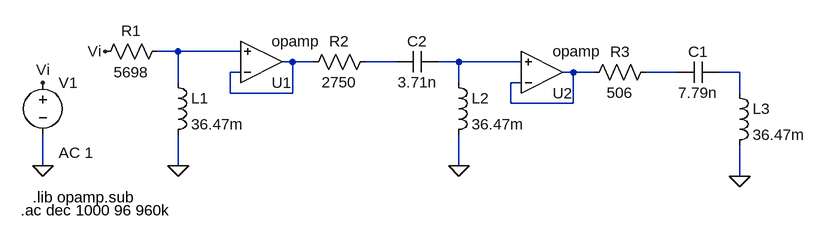
[diagram p0: schematic circ.asc]
circ.asc, the LTspice schematic file:
Version 4
SHEET 1 1008 680
WIRE 32 112 0 112
WIRE 128 112 32 112
WIRE 208 128 192 128
WIRE 240 128 208 128
WIRE 368 128 320 128
WIRE 464 128 432 128
WIRE 560 128 464 128
WIRE 128 144 112 144
WIRE 640 144 624 144
WIRE 672 144 640 144
WIRE 800 144 752 144
WIRE 896 144 864 144
WIRE 32 160 32 112
WIRE 464 160 464 128
WIRE 560 160 544 160
WIRE 112 176 112 144
WIRE 208 176 208 128
WIRE 208 176 112 176
WIRE 896 176 896 144
WIRE 544 192 544 160
WIRE 640 192 640 144
WIRE 640 192 544 192
WIRE -176 288 -176 240
WIRE 32 288 32 240
WIRE 464 288 464 240
WIRE 896 304 896 256
FLAG 32 288 0
FLAG -176 288 0
FLAG -176 160 Vi
FLAG -80 112 Vi
FLAG 464 288 0
FLAG 896 304 0
SYMBOL res 16 96 R90
WINDOW 0 0 56 VBottom 2
WINDOW 3 32 56 VTop 2
SYMATTR InstName R1
SYMATTR Value 5698
SYMBOL ind 16 144 R0
SYMATTR InstName L1
SYMATTR Value 36.47m
SYMBOL voltage -176 144 R0
WINDOW 123 24 124 Left 2
WINDOW 39 0 0 Left 0
SYMATTR InstName V1
SYMATTR Value ""
SYMATTR Value2 AC 1
SYMBOL OpAmps\\opamp 160 192 M180
SYMATTR InstName U1
SYMBOL res 336 112 R90
WINDOW 0 0 56 VBottom 2
WINDOW 3 32 56 VTop 2
SYMATTR InstName R2
SYMATTR Value 2750
SYMBOL cap 432 112 R90
WINDOW 0 0 32 VBottom 2
WINDOW 3 32 32 VTop 2
SYMATTR InstName C2
SYMATTR Value 3.71n
SYMBOL ind 448 144 R0
SYMATTR InstName L2
SYMATTR Value 36.47m
SYMBOL OpAmps\\opamp 592 208 M180
SYMATTR InstName U2
SYMBOL res 768 128 R90
WINDOW 0 0 56 VBottom 2
WINDOW 3 32 56 VTop 2
SYMATTR InstName R3
SYMATTR Value 506
SYMBOL cap 864 128 R90
WINDOW 0 0 32 VBottom 2
WINDOW 3 32 32 VTop 2
SYMATTR InstName C1
SYMATTR Value 7.79n
SYMBOL ind 880 160 R0
SYMATTR InstName L3
SYMATTR Value 36.47m
TEXT -192 336 Left 2 !.lib opamp.sub
TEXT -210 356 Left 2 !.ac dec 1000 96 960k

The netlist it stands for:
* circ.asc
R1 N001 Vi 5698
L1 N001 0 36.47m
V1 Vi 0 AC 1
XU1 N002 N001 N002 opamp Aol=100K GBW=10Meg  ; pins invin noninvin out
R2 N003 N002 2750
C2 N004 N003 3.71n
L2 N004 0 36.47m
XU2 N005 N004 N005 opamp Aol=100K GBW=10Meg  ; pins invin noninvin out
R3 N006 N005 506
C1 N007 N006 7.79n
L3 N007 0 36.47m
.lib opamp.sub
.ac dec 1000 96 960k
.backanno
.end